# Altium schematic sheet FDCAN&QSPI.SchDoc: FDCAN & QSPI
size A4; DocumentNumber: MB1246; Revision: B.1; SheetNumber: 11; SheetTotal: 17; Project: STM32H7xxI-EVAL
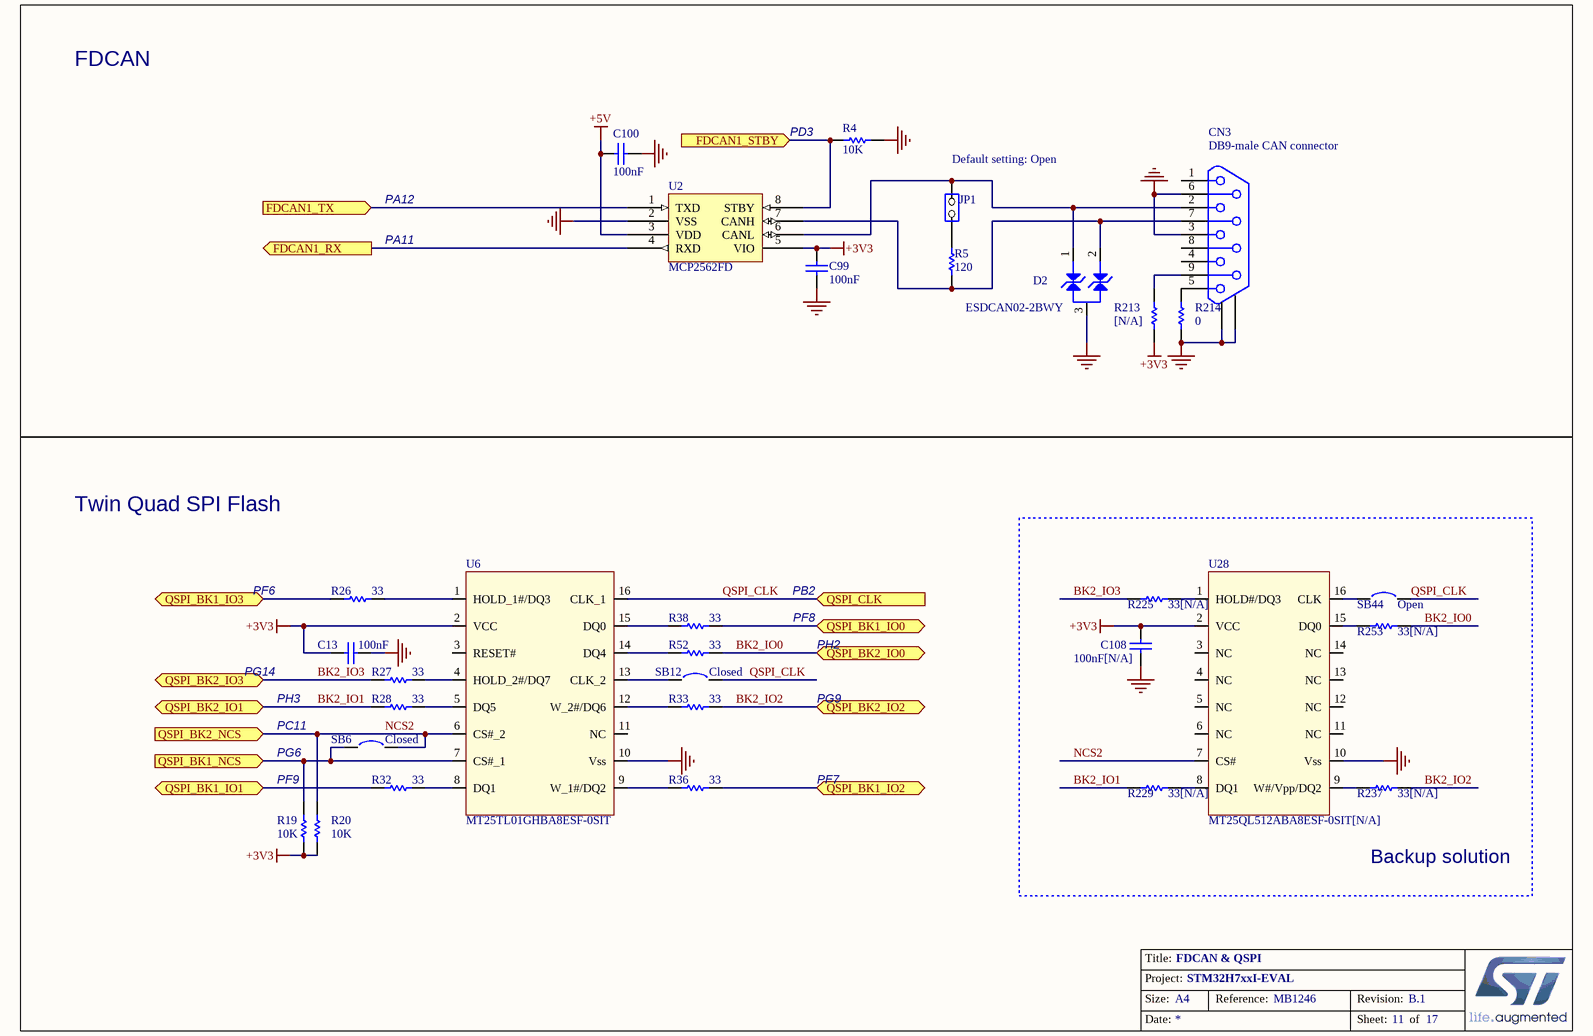
[diagram p0: FDCAN&QSPI.SchDoc]

## Parts
C13  100nF  [0402C]
C99  100nF  [0603C]
C100  100nF  [0603C]
C108  100nF[N/A]  [0402C]
CN3  DB9-male CAN connector  [DB9/M]
D2  ESDCAN02-2BWY  [SOT-323]
JP1  (no value)  [SIP2]
R4  10K  [0603R]
R5  120  [0603R]
R19  10K  [0402R]
R20  10K  [0402R]
R26  33  [0603R]
R27  33  [0603R]
R28  33  [0603R]
R32  33  [0603R]
R33  33  [0603R]
R36  33  [0603R]
R38  33  [0603R]
R52  33  [0603R]
R213  [N/A]  [0603R]
R214  0  [0603R]
R225  33[N/A]  [0603R]
R229  33[N/A]  [0603R]
R237  33[N/A]  [0603R]
R253  33[N/A]  [0603R]
SB6  Closed  [SB_0603]
SB12  Closed  [SB_0603]
SB44  Open  [SB_0603]
U2  MCP2562FD  [SOIC8_1R27_4R9X6]
U6  MT25TL01GHBA8ESF-0SIT  [SOIC16W_1R27_10R3X10R33]
U28  MT25QL512ABA8ESF-0SIT[N/A]  [SOIC16W_1R27_10R3X10R33]

## Blocks framed on the sheet
Backup solution: C108 R225 R229 R237 R253 SB44 U28

## Ports
FDCAN1_RX (out), FDCAN1_STBY (in), FDCAN1_TX (in), QSPI_BK1_IO0 (bidir), QSPI_BK1_IO1 (bidir), QSPI_BK1_IO2 (bidir), QSPI_BK1_IO3 (bidir), QSPI_BK1_NCS (in), QSPI_BK2_IO0 (bidir), QSPI_BK2_IO1 (bidir), QSPI_BK2_IO2 (bidir), QSPI_BK2_IO3 (bidir), QSPI_BK2_NCS (in), QSPI_CLK (in)

## Nets
+3V3: C13.1 C99.1 C108.1 R19.2 R20.2 R213.1 U2.5(VIO) U6.2(VCC) U28.2(VCC)
+5V: C100.1 U2.3(VDD)
GND: C13.2 C99.2 C100.2 C108.2 CN3.3 CN3.6 CN3.10 CN3.11 D2.3 R4.2 R214.1 U2.2(VSS) U6.10(Vss) U28.10(Vss)
BK2_IO0: R52.1 R253.1 ; port QSPI_BK2_IO0
BK2_IO1: R28.2 R229.2 ; port QSPI_BK2_IO1
BK2_IO2: R33.1 R237.1 ; port QSPI_BK2_IO2
BK2_IO3: R27.2 R225.2 ; port QSPI_BK2_IO3
FDCAN1_RX: U2.4(RXD) ; port FDCAN1_RX
FDCAN1_STBY: R4.1 U2.8(STBY) ; port FDCAN1_STBY
FDCAN1_TX: U2.1(TXD) ; port FDCAN1_TX
NCS2: R20.1 SB6.2 U6.6(CS#_2) U28.7(CS#) ; port QSPI_BK2_NCS
QSPI_BK1_IO0: R38.1 ; port QSPI_BK1_IO0
QSPI_BK1_IO1: R32.2 ; port QSPI_BK1_IO1
QSPI_BK1_IO2: R36.1 ; port QSPI_BK1_IO2
QSPI_BK1_IO3: R26.2 ; port QSPI_BK1_IO3
QSPI_BK1_NCS: R19.1 SB6.1 U6.7(CS#_1) ; port QSPI_BK1_NCS
QSPI_CLK: SB12.2 SB44.2 U6.16(CLK_1) ; port QSPI_CLK
NetCN3_2: CN3.2 D2.1 JP1.2(NO) U2.6(CANL)
NetCN3_5: CN3.5 R214.2
NetCN3_7: CN3.7 D2.2 R5.1 U2.7(CANH)
NetCN3_9: CN3.9 R213.2
NetJP1_1: JP1.1(COMMON) R5.2
NetR26_1: R26.1 U6.1(HOLD_1#/DQ3)
NetR27_1: R27.1 U6.4(HOLD_2#/DQ7)
NetR28_1: R28.1 U6.5(DQ5)
NetR32_1: R32.1 U6.8(DQ1)
NetR33_2: R33.2 U6.12(W_2#/DQ6)
NetR36_2: R36.2 U6.9(W_1#/DQ2)
NetR38_2: R38.2 U6.15(DQ0)
NetR52_2: R52.2 U6.14(DQ4)
NetR225_1: R225.1 U28.1(HOLD#/DQ3)
NetR229_1: R229.1 U28.8(DQ1)
NetR237_2: R237.2 U28.9(W#/Vpp/DQ2)
NetR253_2: R253.2 U28.15(DQ0)
NetSB12_1: SB12.1 U6.13(CLK_2)
NetSB44_1: SB44.1 U28.16(CLK)

Not connected (* = marked no-connect by the designer): CN3 1 4 8; U6 3(RESET#) 11(NC); U28 3(NC) 4(NC) 5(NC) 6(NC) 11(NC) 12(NC) 13(NC) 14(NC)

## Notes on the sheet
- FDCAN
- (near R4) PD3
- (near JP1) Default setting: Open
- PA12
- PA11
- Twin Quad SPI Flash
- PF6
- PF8
- PB2
- PH2
- (near C13) PG14
- PH3
- PG9
- PF9
- PG6
- PC11
- PF7
- Title:
- Project:
- Size:
- Date:
- A4
- Reference:
- Sheet:
- Revision:
- of

## Library data of the parts
C13 C108 = Cap: Capacitor; Value: 10nF; Ordered by: Subcon; Published: 8-Jun-2000; Revision: July-2002: Re-released for DXP Platform.; Publisher: Altium Limited
C99 C100 = Cap: Capacitor; Value: 10nF; Published: 8-Jun-2000; Revision: July-2002: Re-released for DXP Platform.; Publisher: Altium Limited
CN3 = DB9-CAN
JP1 = JP2
R4 R26-R28 R32 R33 R36 R38 R52 R225 R229 R237 R253 = Res1: Resistor; Value: 1K; Published: 8-Jun-2000; Revision: July-2002: Re-released for DXP Platform.; Publisher: Altium Limited
R5 R213 R214 = res1: Resistor; Value: 1K; Published: 8-Jun-2000; Revision: July-2002: Re-released for DXP Platform.; Publisher: Altium Limited
R19 R20 = res1: Resistor; Value: 1K; Ordered by: Subcon; Published: 8-Jun-2000; Revision: July-2002: Re-released for DXP Platform.; Publisher: Altium Limited
SB6 SB12 = Circuit Breaker_close: Circuit Breaker; Published: 24-Mar-1999; Revision: July-2002: Re-released for DXP Platform.; Publisher: Altium Limited
SB44 = Circuit Breaker: Published: 24-Mar-1999; Revision: July-2002: Re-released for DXP Platform.; Publisher: Altium Limited
U2 = MCP2562FD: CAN Flexible Data Rate Transceiver
U6 = MT25TL01GHBA8ESF-0SIT: Serial NOR Flash Memory; ECCN_US/EU: 3A991
U28 = QSPI_16pins: ECCN_US/EU: 3A991